# Altium schematic sheet SCH_4_Touch Sensors.SchDoc
size A
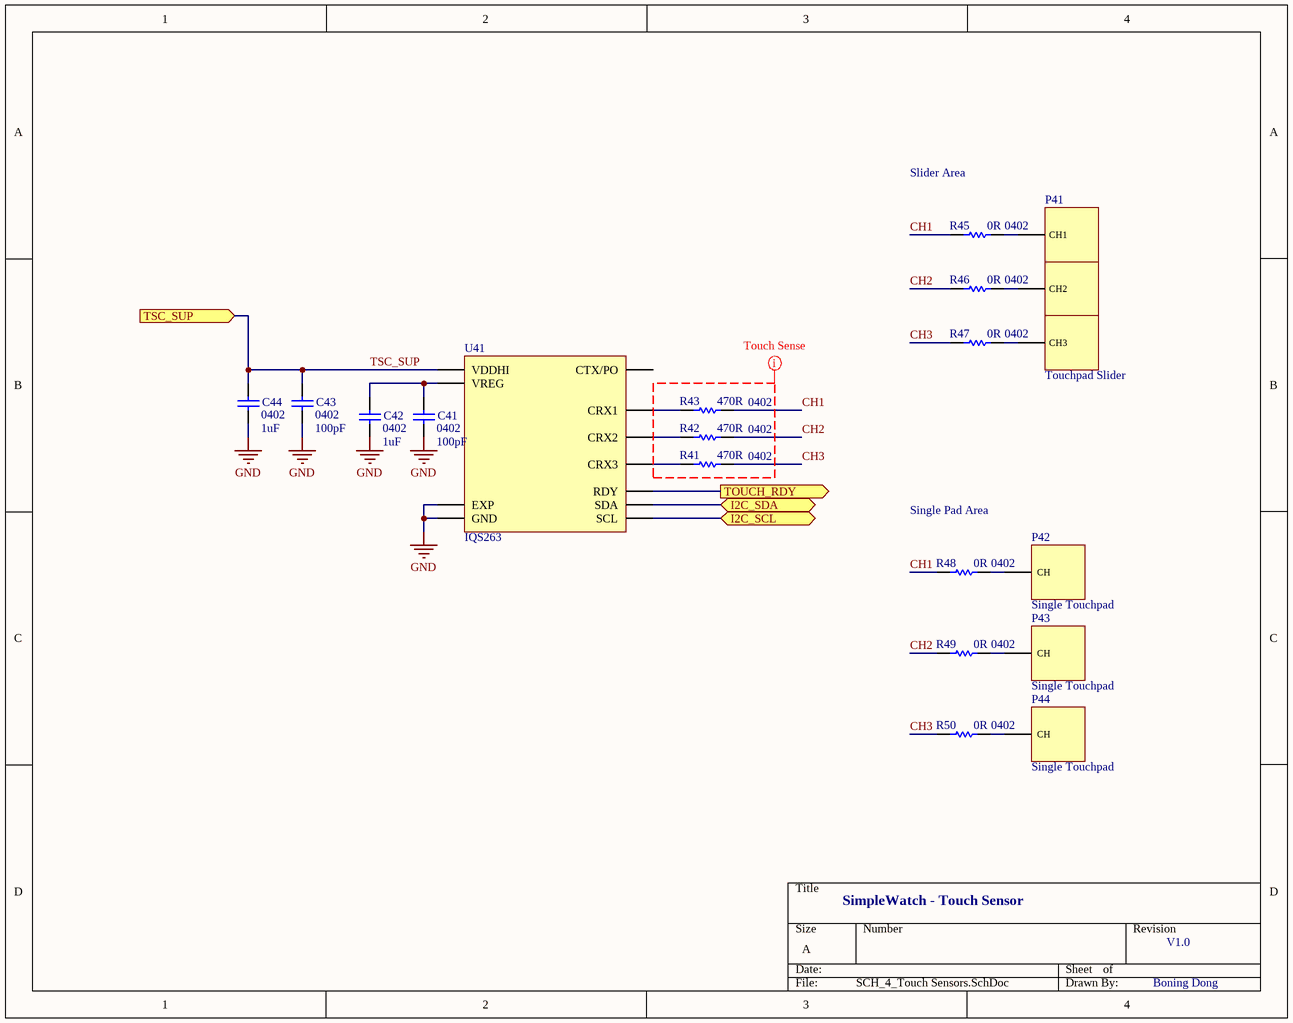
[diagram p0: SCH_4_Touch Sensors.SchDoc]

## Parts
C41  0402  value 100pF  [CAPC1005X07N]
C42  0402  value 1uF  [CAPC1005X07N]
C43  0402  value 100pF  [CAPC1005X07N]
C44  0402  value 1uF  [CAPC1005X07N]
P41  Touchpad Slider  [TPAD_SLIDER_21X7]
P42  Single Touchpad  [TPAD_8X8]
P43  Single Touchpad  [TPAD_8X8]
P44  Single Touchpad  [TPAD_8X8]
R41  0402  value 470R  [RESC1005X04N]
R42  0402  value 470R  [RESC1005X04N]
R43  0402  value 470R  [RESC1005X04N]
R45  0402  value 0R  [RESC1005X04N]
R46  0402  value 0R  [RESC1005X04N]
R47  0402  value 0R  [RESC1005X04N]
R48  0402  value 0R  [RESC1005X04N]
R49  0402  value 0R  [RESC1005X04N]
R50  0402  value 0R  [RESC1005X04N]
U41  IQS263  [DFN50P300X300-10N_HS240X150]

## Ports
I2C_SCL (bidir), I2C_SDA (bidir), TOUCH_RDY (out), TSC_SUP (in)

## Nets
GND: C41.1 C42.1 C43.1 C44.1 U41.1(GND) U41.11(EXP)
CH1: R43.2 R45.1 R48.1
CH2: R42.2 R46.1 R49.1
CH3: R41.2 R47.1 R50.1
I2C_SCL: U41.8(SCL) ; port I2C_SCL
I2C_SDA: U41.7(SDA) ; port I2C_SDA
TOUCH_RDY: U41.6(RDY) ; port TOUCH_RDY
TSC_SUP: C43.2 C44.2 U41.4(VDDHI) ; port TSC_SUP
NetC41_2: C41.2 C42.2 U41.5(VREG)
NetP41_1: P41.1(CH1) R45.2
NetP41_2: P41.2(CH2) R46.2
NetP41_3: P41.3(CH3) R47.2
NetP42_1: P42.1(CH) R48.2
NetP43_1: P43.1(CH) R49.2
NetP44_1: P44.1(CH) R50.2
NetR41_1: R41.1 U41.9(CRX3)
NetR42_1: R42.1 U41.3(CRX2)
NetR43_1: R43.1 U41.2(CRX1)

Not connected (* = marked no-connect by the designer): U41 10(CTX/PO)

## Layout directives
net class TOUCH_SENSE_CHANNEL: (no net found under the mark)

## Notes on the sheet
- Slider Area
- Single Pad Area
- SimpleWatch - Touch Sensor
- V1.0
- Boning Dong

## Library data of the parts
C41-C44 = Cap: Capacitor; Published: 8-Jun-2000; LatestRevisionDate: 17-Jul-2002; LatestRevisionNote: Re-released for DXP Platform.; PackageReference: RAD-0.3; Publisher: Altium Limited; PackageDescription: Radial Cap, Thru-Hole; 2 Leads; 0.3 in Pin Spacing
P41 = PAD_SLIDER_3CH: General Slider Touchpad
P42-P44 = PAD_SINGLE: General Single Touchpad
R41-R43 R45-R50 = Res1: Resistor; Published: 8-Jun-2000; LatestRevisionDate: 17-Jul-2002; LatestRevisionNote: Re-released for DXP Platform.; PackageReference: AXIAL-0.3; Publisher: Altium Limited; PackageDescription: Axial Device, Thru-Hole; 2 Leads; 0.3 in Pin Spacing
U41 = AZOTEQ_IQS263: 3 Channel Capacitive Touch Sensor. Capacitive Touch Buttons, Slider, Wheel 10-DFN (3x3)